# EAGLE schematic DeviceDOut24 (EAGLE 5.00)
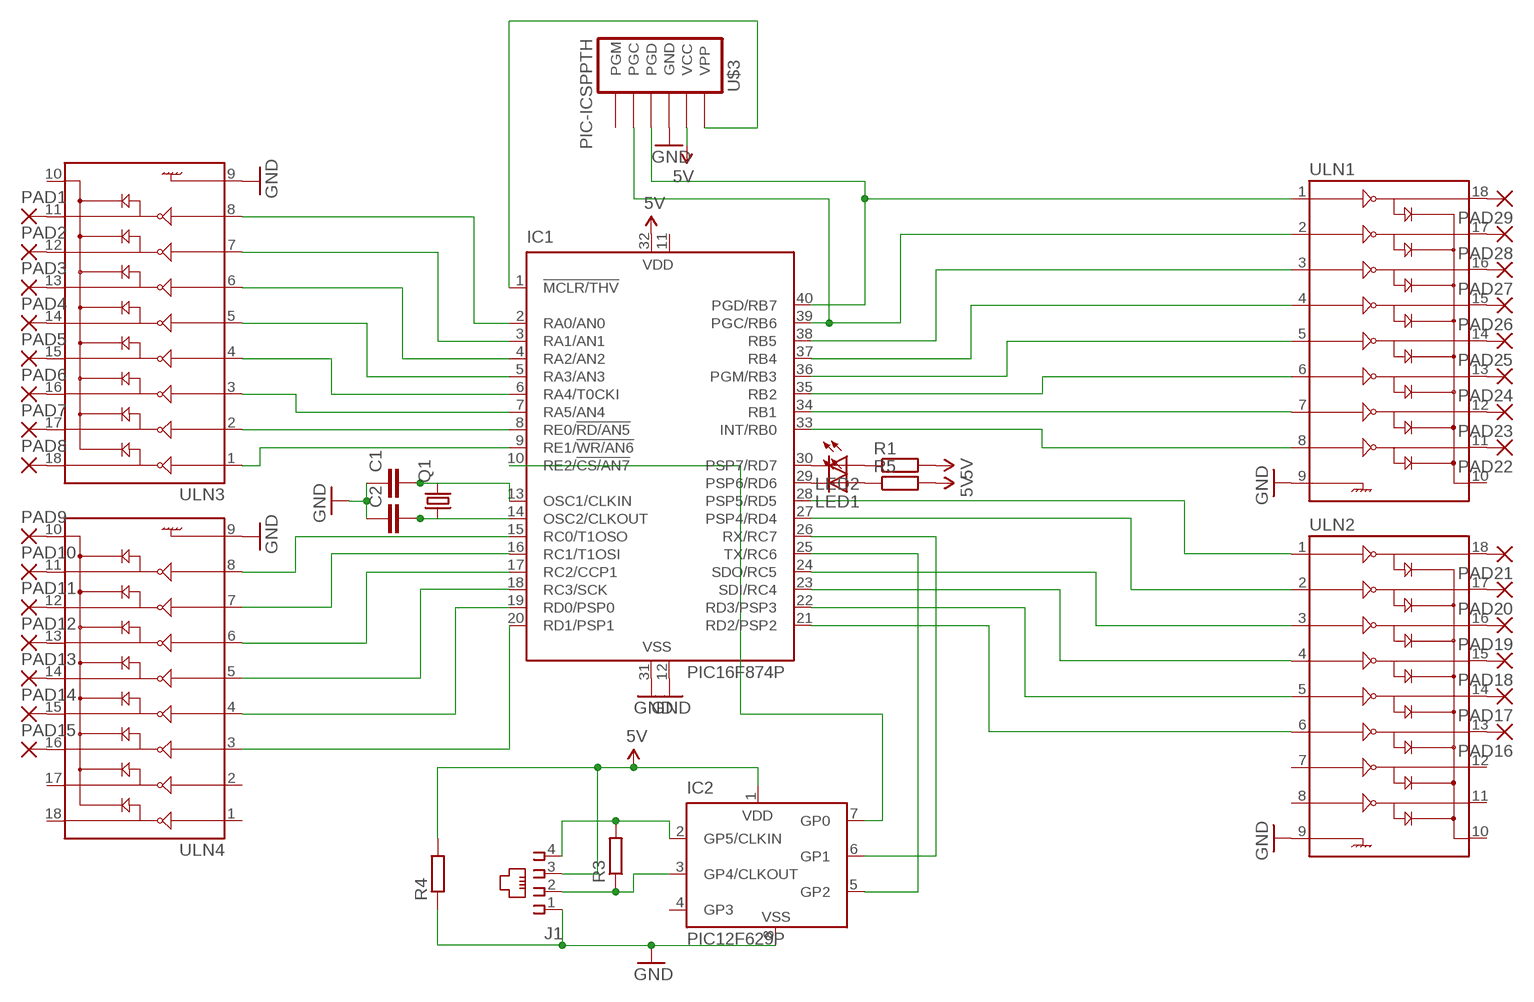
[diagram p0: schematic, sheet 1]

## Parts
C1  C2.5/2  [C2.5-2]
C2  C2.5/2  [C2.5-2]
IC1  PIC16F874P  [DIL40]
IC2  PIC12F629P  [DIL8]
J1  215876-6  [215876-6]
LED1  LED3MM  [LED3MM]
LED2  LED3MM  [LED3MM]
PAD1  2,15/1,0  [2,15/1,0]
PAD2  2,15/1,0  [2,15/1,0]
PAD3  2,15/1,0  [2,15/1,0]
PAD4  2,15/1,0  [2,15/1,0]
PAD5  2,15/1,0  [2,15/1,0]
PAD6  2,15/1,0  [2,15/1,0]
PAD7  2,15/1,0  [2,15/1,0]
PAD8  2,15/1,0  [2,15/1,0]
PAD9  2,15/1,0  [2,15/1,0]
PAD10  2,15/1,0  [2,15/1,0]
PAD11  2,15/1,0  [2,15/1,0]
PAD12  2,15/1,0  [2,15/1,0]
PAD13  2,15/1,0  [2,15/1,0]
PAD14  2,15/1,0  [2,15/1,0]
PAD15  2,15/1,0  [2,15/1,0]
PAD16  2,15/1,0  [2,15/1,0]
PAD17  2,15/1,0  [2,15/1,0]
PAD18  2,15/1,0  [2,15/1,0]
PAD19  2,15/1,0  [2,15/1,0]
PAD20  2,15/1,0  [2,15/1,0]
PAD21  2,15/1,0  [2,15/1,0]
PAD22  2,15/1,0  [2,15/1,0]
PAD23  2,15/1,0  [2,15/1,0]
PAD24  2,15/1,0  [2,15/1,0]
PAD25  2,15/1,0  [2,15/1,0]
PAD26  2,15/1,0  [2,15/1,0]
PAD27  2,15/1,0  [2,15/1,0]
PAD28  2,15/1,0  [2,15/1,0]
PAD29  2,15/1,0  [2,15/1,0]
Q1  CRYSTALHC49U70  [HC49U70]
R1  R-EU_0204/2V  [0204V]
R3  R-EU_0204/2V  [0204V]
R4  R-EU_0204/7  [0204/7]
R5  R-EU_0204/2V  [0204V]
U$3  PIC-ICSPPTH  [MOLEX-1X6]
ULN1  ULN2803DIP  [DIL18]
ULN2  ULN2803DIP  [DIL18]
ULN3  ULN2803DIP  [DIL18]
ULN4  ULN2803DIP  [DIL18]

## Nets
5V: IC1.32(VDD) IC2.1(VDD) J1.3 R1.2 R4.2 R5.2 U$3.5(VCC)
GND: C1.1 C2.1 IC1.12(VSS) IC1.31(VSS) IC2.8(VSS) J1.1 R4.1 U$3.4(GND) ULN1.9 ULN2.9 ULN3.9 ULN4.9
N$1: IC1.1(!MCLR/THV) U$3.6(VPP)
N$2: IC1.40(PGD/RB7) U$3.3(PGD) ULN1.1
N$3: IC1.28(PSP5/RD5) ULN2.1
N$4: IC1.27(PSP4/RD4) ULN2.2
N$5: C1.2 IC1.13(OSC1/CLKIN) Q1.2
N$6: C2.2 IC1.14(OSC2/CLKOUT) Q1.1
N$7: IC1.26(RX/RC7) IC2.6(GP1)
N$10: IC1.39(PGC/RB6) U$3.2(PGC) ULN1.2
N$11: IC1.38(RB5) ULN1.3
N$12: IC1.37(RB4) ULN1.4
N$13: IC1.36(PGM/RB3) ULN1.5
N$14: IC1.35(RB2) ULN1.6
N$15: IC1.30(PSP7/RD7) LED2.K(C)
N$16: IC1.24(SDO/RC5) ULN2.3
N$17: IC1.23(SDI/RC4) ULN2.4
N$18: IC1.22(RD3/PSP3) ULN2.5
N$19: IC1.21(RD2/PSP2) ULN2.6
N$20: IC1.15(RC0/T1OSO) ULN4.8
N$21: IC1.16(RC1/T1OSI) ULN4.7
N$22: IC1.17(RC2/CCP1) ULN4.6
N$23: IC1.18(RC3/SCK) ULN4.5
N$24: IC1.2(RA0/AN0) ULN3.8
N$25: IC1.3(RA1/AN1) ULN3.7
N$26: IC1.4(RA2/AN2) ULN3.6
N$27: IC1.5(RA3/AN3) ULN3.5
N$28: IC1.6(RA4/T0CKI) ULN3.4
N$29: IC1.7(RA5/AN4) ULN3.3
N$30: IC1.8(RE0/!RD/AN5) ULN3.2
N$31: IC1.9(RE1/!WR/AN6) ULN3.1
N$32: IC1.19(RD0/PSP0) ULN4.4
N$33: IC1.20(RD1/PSP1) ULN4.3
N$34: LED2.A R1.1
N$35: LED1.A R5.1
N$36: PAD1.1(P) ULN3.11
N$37: PAD2.1(P) ULN3.12
N$38: PAD3.1(P) ULN3.13
N$39: PAD4.1(P) ULN3.14
N$40: IC1.34(RB1) ULN1.7
N$41: IC1.33(INT/RB0) ULN1.8
N$42: PAD5.1(P) ULN3.15
N$43: PAD6.1(P) ULN3.16
N$44: PAD7.1(P) ULN3.17
N$45: PAD8.1(P) ULN3.18
N$46: PAD9.1(P) ULN4.10
N$47: PAD10.1(P) ULN4.11
N$48: PAD11.1(P) ULN4.12
N$49: PAD12.1(P) ULN4.13
N$50: PAD13.1(P) ULN4.14
N$51: PAD14.1(P) ULN4.15
N$52: PAD15.1(P) ULN4.16
N$53: PAD16.1(P) ULN2.13
N$54: PAD17.1(P) ULN2.14
N$55: PAD18.1(P) ULN2.15
N$56: PAD19.1(P) ULN2.16
N$57: PAD20.1(P) ULN2.17
N$58: PAD21.1(P) ULN2.18
N$59: PAD22.1(P) ULN1.11
N$60: PAD23.1(P) ULN1.12
N$61: PAD24.1(P) ULN1.13
N$62: PAD25.1(P) ULN1.14
N$63: PAD26.1(P) ULN1.15
N$64: PAD27.1(P) ULN1.16
N$65: PAD28.1(P) ULN1.17
N$66: PAD29.1(P) ULN1.18
N$67: IC1.29(PSP6/RD6) LED1.K(C)
N$68: IC2.3(GP4/CLKOUT) J1.2 R3.1
N$69: IC2.2(GP5/CLKIN) J1.4 R3.2
N$71: IC1.10(RE2/!CS/AN7) IC2.7(GP0)
N$73: IC1.25(TX/RC6) IC2.5(GP2)
Unconnected: IC2.4(GP3) U$3.1(PGM) ULN1.10 ULN2.7 ULN2.8 ULN2.10 ULN2.11 ULN2.12 ULN3.10 ULN4.1 ULN4.2 ULN4.17 ULN4.18

## Power pins joined to a net without a drawn wire
VDD: IC1.11(VDD)

## Library data of the parts
C1 C2 = capacitor-wima:C: CAPACITOR naming: grid - package width
IC1 = microchip:PIC16F87*: MICROCONTROLLER
IC2 = microchip:PIC12F6*: Data Sheet 8-Pin FLASH-Based 8-Bit CMOS Microcontrollers Source: http://www.microchip.com .. 41190c.pdf
J1 = con-amp:215876-6: AMP connector
LED1 LED2 = led:LED: LED OSRAM: - CHIPLED LG R971, LG N971, LY N971, LG Q971, LY Q971, LO R971, LY R971 LH N974, LH R974 LS Q976, LO Q976, LY Q976 LO Q996 - Hyper CHIPLED LW Q18S LB Q993, LB Q99A, LB R99A - SideLED LS A670, LO A670, LY A670, LG A670, LP A670 LB A673, LV A673, LT A673, LW A673 LH A674 LY A675 LS A676, LA A676, LO A676, LY A676, LW A676 LS A679, LY A679, LG A679 - Hyper Micro SIDELED® LS Y876, LA Y876, LO Y876, LY Y876 LT Y87S - SmartLED LW L88C, LW L88S LB L89C, LB L89S, LG L890 LS L89K, LO L89K, LY L89K LS L896, LA L896, LO L896, LY L896 - TOPLED LS T670, LO T670, LY T670, LG T670, LP T670 LSG T670, LSP T670, LSY T670, LOP T670, LYG T670 LG T671, LOG T671, LSG T671 LB T673, LV T673, LT T673, LW T673 LH T674 LS T676, LA T676, LO T676, LY T676, LB T676, LH T676, LSB T676, LW T676 LB T67C, LV T67C, LT T67C, LS T67K, LO T67K, LY T67K, LW E67C LS E67B, LA E67B, LO E67B, LY E67B, LB E67C, LV E67C, LT E67C LW T67C LS T679, LY T679, LG T679 LS T770, LO T770, LY T770, LG T770, LP T770 LB T773, LV T773, LT T773, LW T773 LH T774 LS E675, LA E675, LY E675, LS T675 LS T776, LA T776, LO T776, LY T776, LB T776 LHGB T686 LT T68C, LB T68C - Hyper Mini TOPLED® LB M676 - Mini TOPLED Santana® LG M470 LS M47K, LO M47K, LY M47K Source: http://www.osram.convergy.de LUXEON: - LUMILED® LXK2-PW12-R00, LXK2-PW12-S00, LXK2-PW14-U00, LXK2-PW14-V00 LXK2-PM12-R00, LXK2-PM12-S00, LXK2-PM14-U00 LXK2-PE12-Q00, LXK2-PE12-R00, LXK2-PE12-S00, LXK2-PE14-T00, LXK2-PE14-U00 LXK2-PB12-K00, LXK2-PB12-L00, LXK2-PB12-M00, LXK2-PB14-N00, LXK2-PB14-P00, LXK2-PB14-Q00 LXK2-PR12-L00, LXK2-PR12-M00, LXK2-PR14-Q00, LXK2-PR14-R00 LXK2-PD12-Q00, LXK2-PD12-R00, LXK2-PD12-S00 LXK2-PH12-R00, LXK2-PH12-S00 LXK2-PL12-P00, LXK2-PL12-Q00, LXK2-PL12-R00 Source: www.luxeon.com KINGBRIGHT: KA-3528ASYC Source: www.kingbright.com
PAD1-PAD29 = wirepad:2,15/1,0: THROUGH-HOLE PAD
Q1 = crystal:CRYSTAL: CRYSTAL
R1 R3-R5 = resistor:R-EU_: RESISTOR, European symbol
U$3 = SparkFun:PIC-ICSP: ISCP Programming connector for UAV, UBW Kit, etc.
ULN1-ULN4 = SparkFun:ULN2803: Darlington Driver ULN2803 Darlington array. 500mA max per channel, 8-channel package. Spark Fun Electronics SKU : COM-00312